# EasyEDA Pro project ModulePlayAndCharge.epro

# Schematic PlayAndCharge_REV1

## Sheets
1 Power: Board Name: PlayAndCharge_REV1_1; Create Date: 2025-07-18; Page Name: Power; Project Name: PlayAndChargeModule; Schematic Name: PlayAndCharge_REV1_1; Update Date: 2025-07-18; Company: ESP32SimWheel; Drawn: Afpineda; Page Size: A4; Version: V1.0
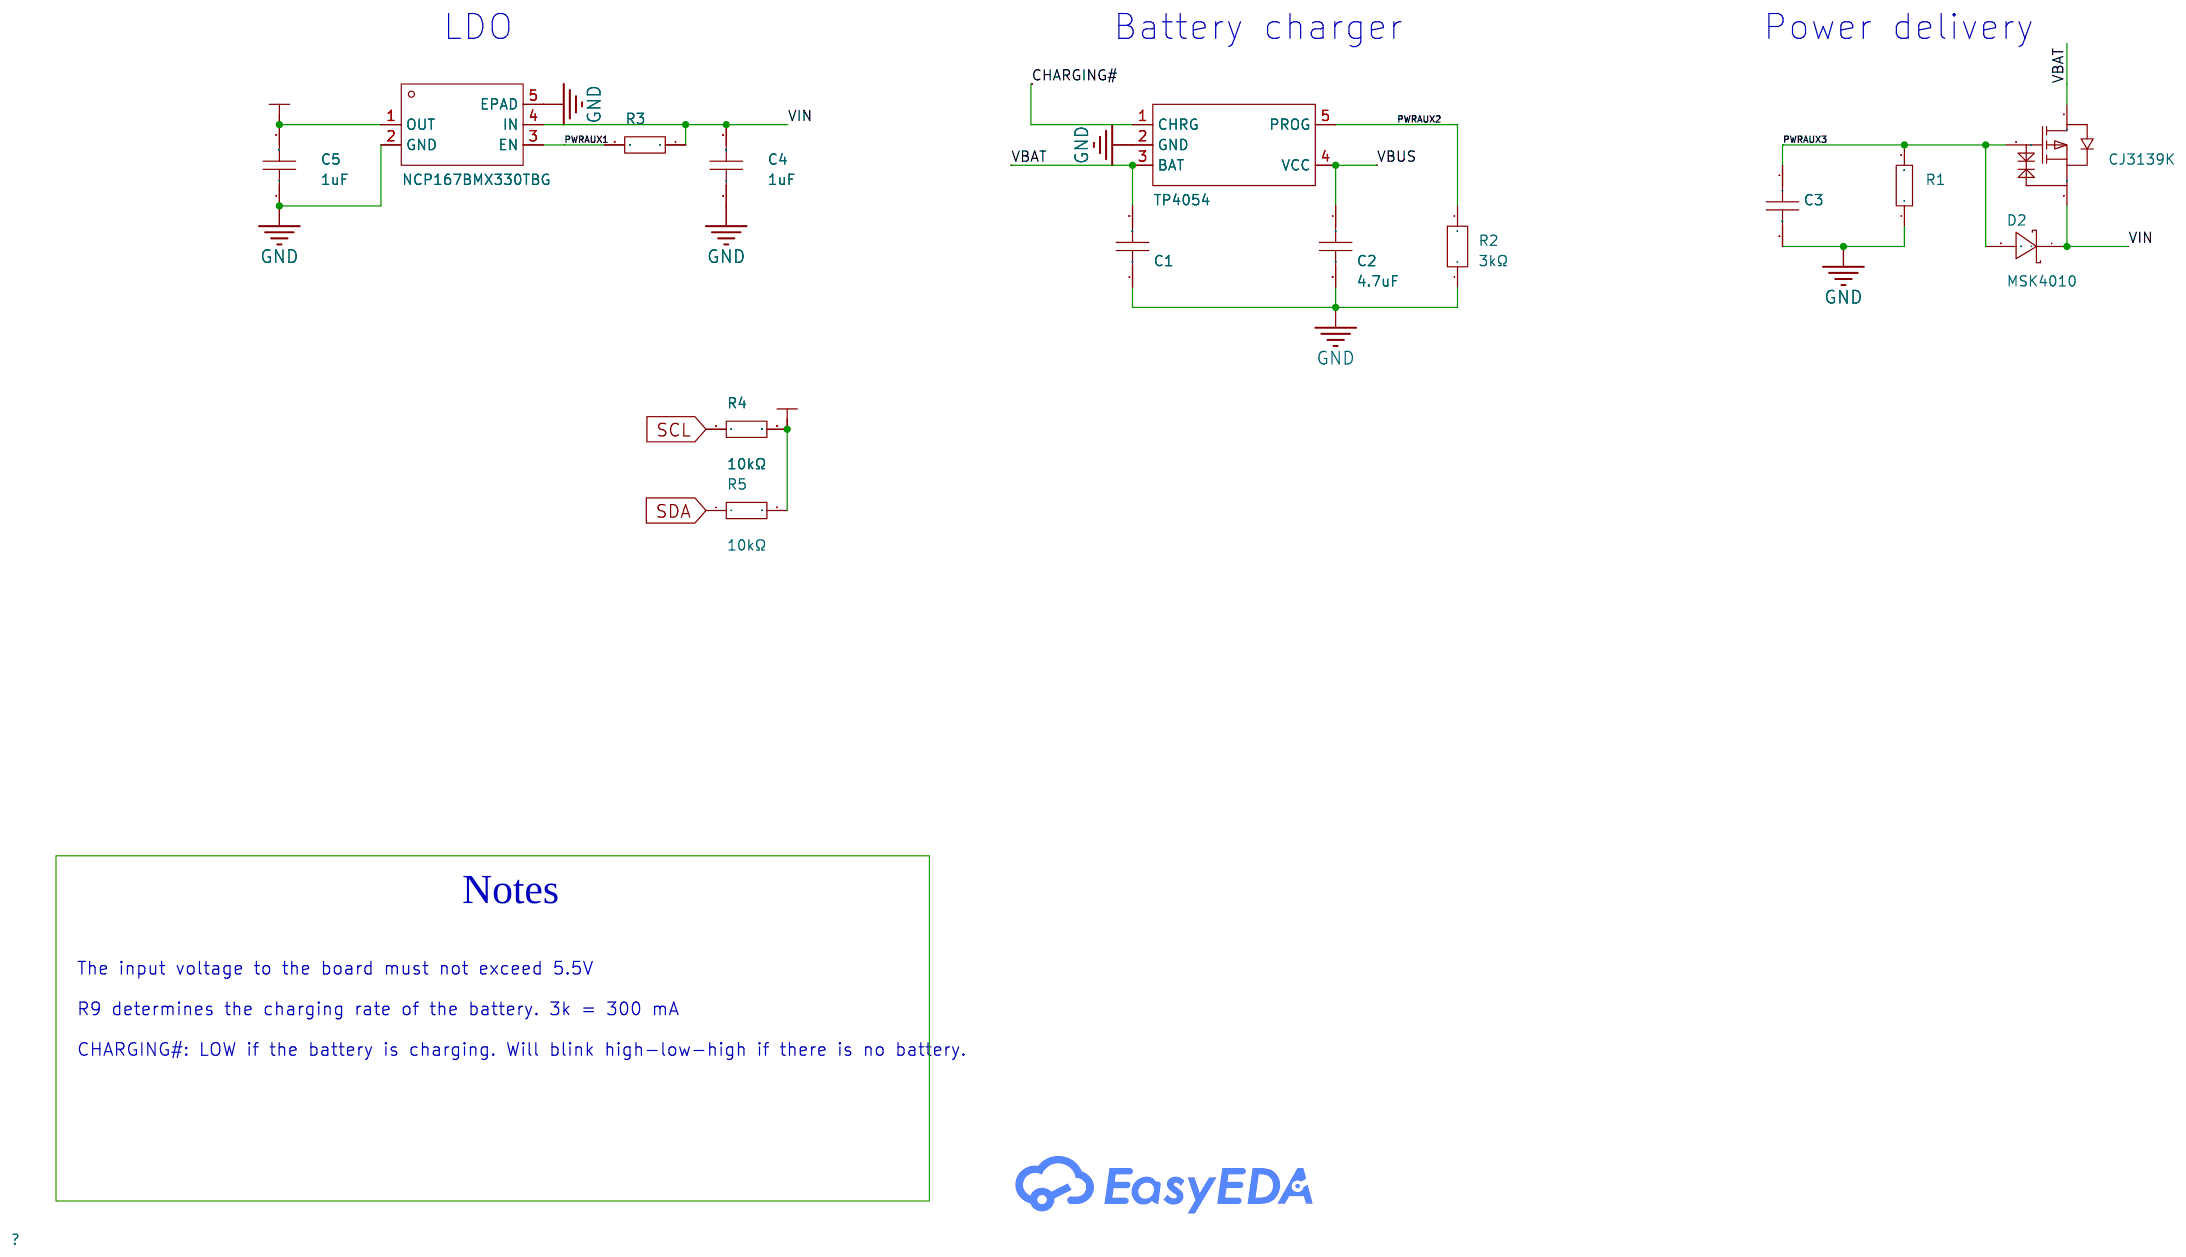
[diagram p0: Power]
2 GPIOExpanders: Board Name: PlayAndCharge_REV1; Page Name: GPIOExpanders; Schematic Name: PlayAndCharge_REV1
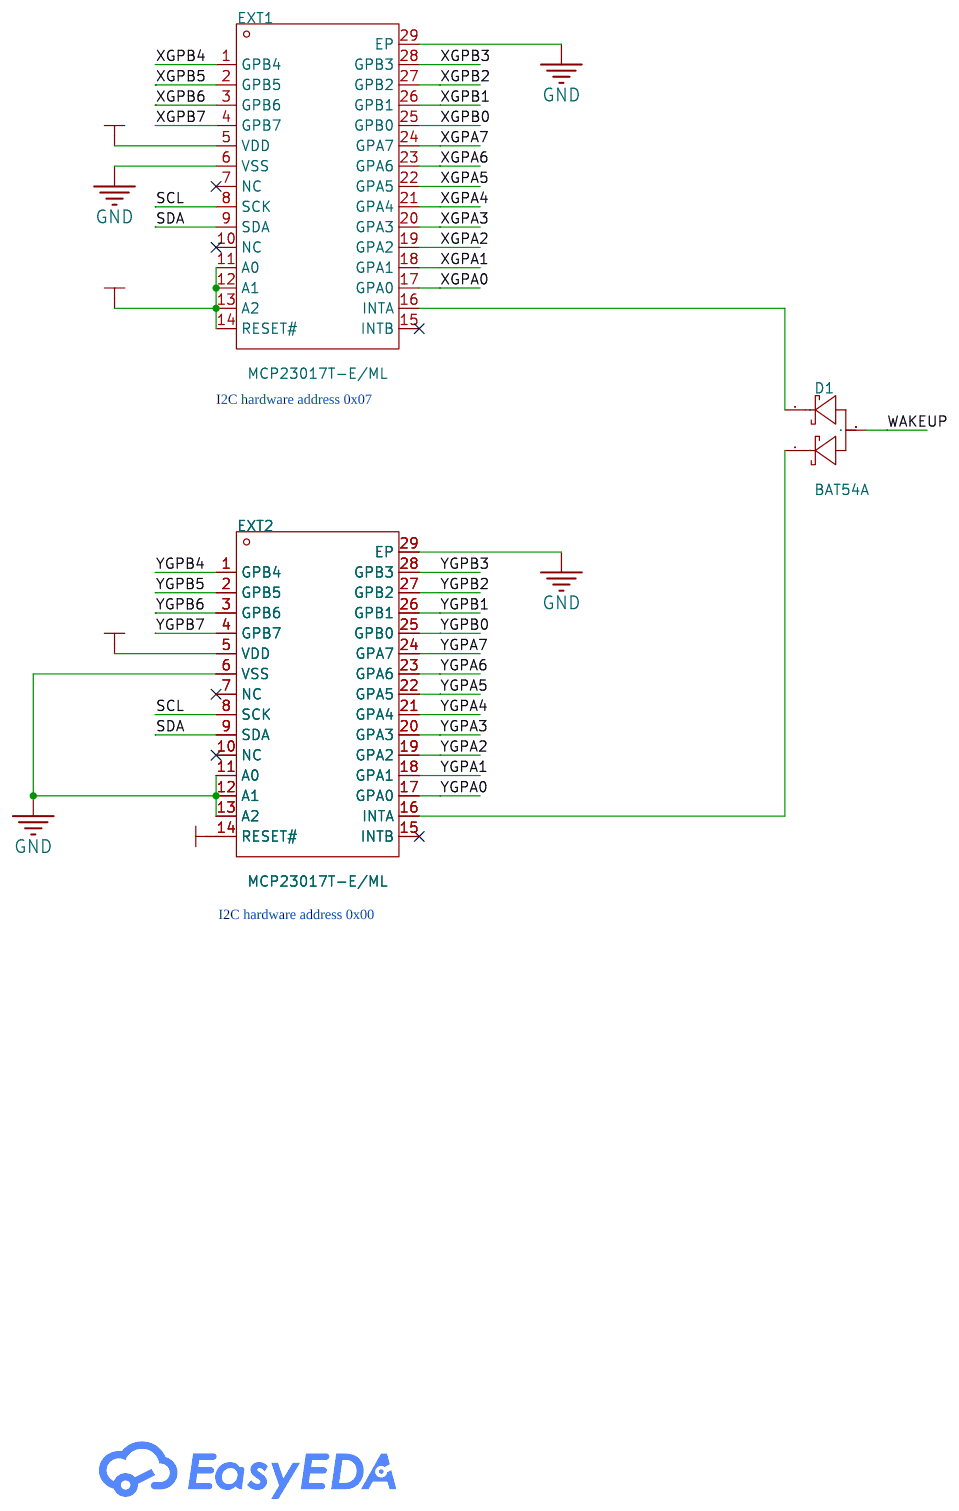
[diagram p1: GPIOExpanders]
3 Connectors: Board Name: PlayAndCharge_REV1; Page Name: Connectors; Schematic Name: PlayAndCharge_REV1; Company: EasyEDA.com
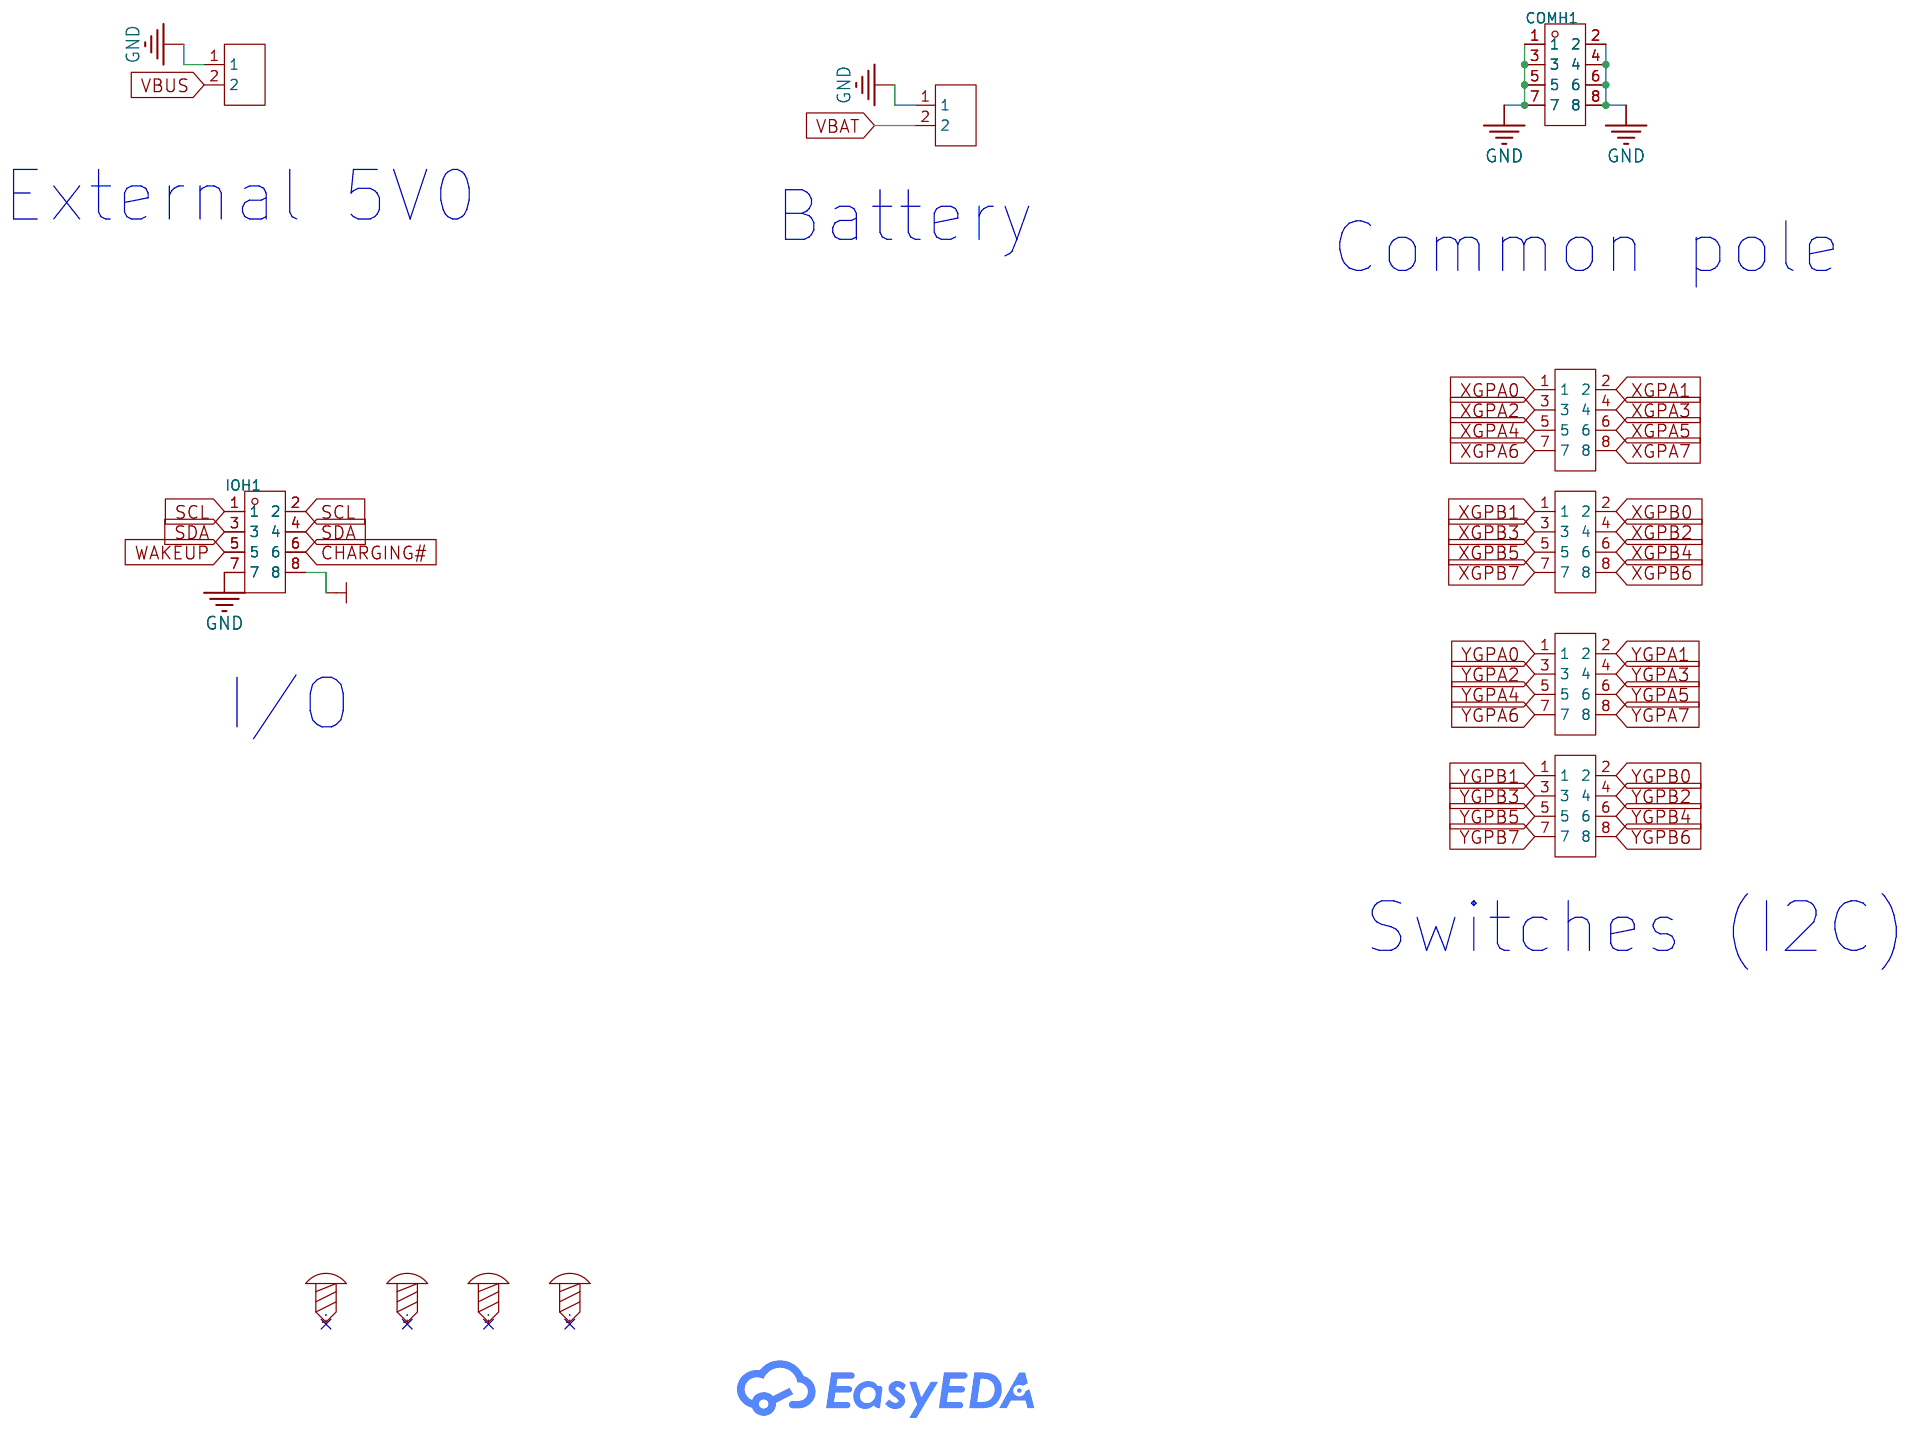
[diagram p2: Connectors]
4 FuelGauge: Board Name: SimWheelKit_batt_holder; Create Date: 2025-07-16; Page Name: FuelGauge; Project Name: SimWheelKit_ESP32_S3Mini_Batt; Schematic Name: Main_1; Update Date: 2025-07-16; Company: EasyEDA.com
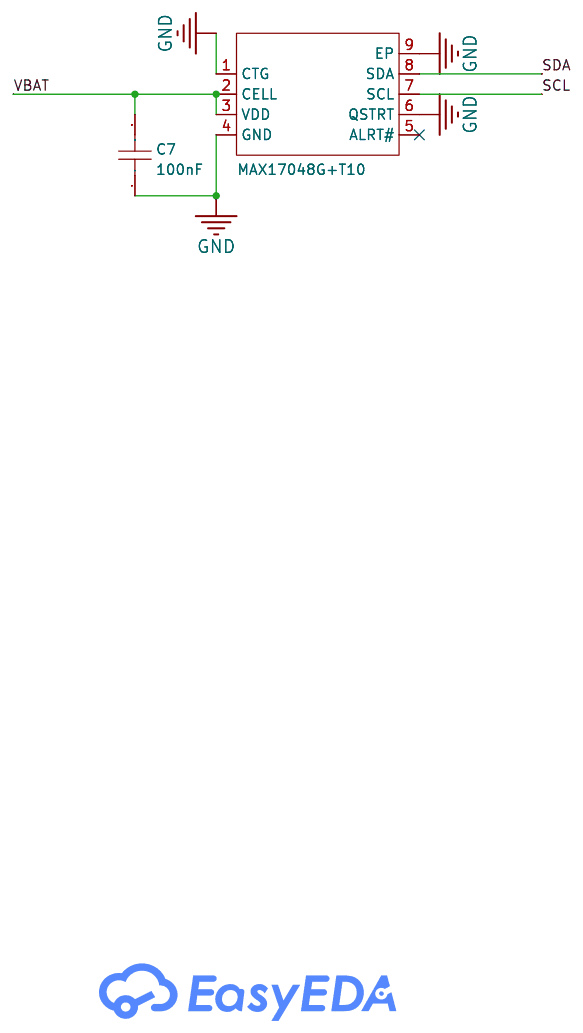
[diagram p3: FuelGauge]

## Parts
sheet Connectors
BATTH1  PZ254R-11-02P  [HDR-TH_2P-P2.54-H-M-W10.4]  (no BOM)
COMH1  PZ254R-12-8P  [HDR-TH_8P-P2.54-H-M-R2-C4-S2.54]
IOH1  PZ254R-12-8P  [HDR-TH_8P-P2.54-H-M-R2-C4-S2.54]
PWRH1  PZ254R-11-02P  [HDR-TH_2P-P2.54-H-M-W10.4]  (no BOM)
SCREW1  -  [Screw-Hole-M2]
SCREW2  -  [Screw-Hole-M2]
SCREW3  -  [Screw-Hole-M2]
SCREW4  -  [Screw-Hole-M2]
XH1  PZ254R-12-8P  [HDR-TH_8P-P2.54-H-M-R2-C4-S2.54]
XH2  PZ254R-12-8P  [HDR-TH_8P-P2.54-H-M-R2-C4-S2.54]
YH1  PZ254R-12-8P  [HDR-TH_8P-P2.54-H-M-R2-C4-S2.54]
YH2  PZ254R-12-8P  [HDR-TH_8P-P2.54-H-M-R2-C4-S2.54]
sheet FuelGauge
C7  100nF  [C0603]
U4  MAX17048G+T10  [TDFN-8_L2.0-W2.0-P0.50-BL-EP1.2]
sheet GPIOExpanders
D1  BAT54A  [SOT-23-3_L2.9-W1.3-P1.90-LS2.4-BR]
EXT1  MCP23017T-E/ML  [QFN-28_L6.0-W6.0-P0.65-BL-EP3.7]
EXT2  MCP23017T-E/ML  [QFN-28_L6.0-W6.0-P0.65-BL-EP3.7]
sheet Power
C1  10uF  [C0603]
C2  4.7uF  [C0402]
C3  10uF  [C0603]
C4  1uF  [C0603]
C5  1uF  [C0603]
D2  MSK4010  [SOD-523_L1.2-W0.8-LS1.6-RD]
Q1  CJ3139K  [SOT-723_L1.2-W0.8-P0.40-LS1.2-BR]
R1  100kΩ  [R0402]
R2  3kΩ  [R0402]
R3  100kΩ  [R0402]
R4  10kΩ  [R0402]
R5  10kΩ  [R0402]
U2  TP4054  [SOT-23-5_L2.9-W1.6-P0.95-LS2.8-BR]
U3  NCP167BMX330TBG  [XDFN-4_L1.0-W1.0-P0.65-BL-EP]

## Library data of the parts
BATTH1 PWRH1 = PZ254R-11-02P: Pin Structure:1x2P Pitch:2.54mm Row Spacing:- Circluar Pins/Square Pins:Policy Mounting Type:Right-Angle Number of Rows:Single Row Number of Pins:2P Current Rating:- Voltage Rating (Max):- Length of Mating Pin:6mm Insulation Height:2.5mm Contact Material:; LCSC Part Name: 1x2P 间距:2.54mm 方针 弯插; Supplier Part: C492410; Manufacturer: XFCN(兴飞); Supplier Footprint: 弯插,P=2.54mm; JLCPCB Part Class: Extended Part; Datasheet: https://atta.szlcsc.com/upload/public/pdf/source/20200309/C492410_AD20A982E51A4870F6FD4D2413672598.pdf; Supplier: LCSC; Pin Structure: 1x2P; Pitch: 2.54mm; Circluar Pins/Square Pins: Policy; Mounting Type: Right-Angle; Number of Rows: Single Row; Number of Pins: 2P; Length of Mating Pin: 6mm; Insulation Height: 2.5mm; Contact Material: Brass; Operating Temperature: -40℃~+105℃; Color: Black; Check: false
COMH1 IOH1 XH1 XH2 YH1 YH2 = PZ254R-12-8P: Pin Structure:2x4P Pitch:2.54mm Row Spacing:2.54mm Circluar Pins/Square Pins:Policy Mounting Type:Right-Angle Number of Rows:Double Row Number of Pins:8P Current Rating:- Voltage Rating (Max):- Length of Mating Pin:6mm Insulation Height:2.5mm Contact Mate; LCSC Part Name: 2x4P 间距:2.54mm 方针 弯插; Supplier Part: C492432; Manufacturer: XFCN(兴飞); Supplier Footprint: 弯插,P=2.54mm; JLCPCB Part Class: Extended Part; Datasheet: https://atta.szlcsc.com/upload/public/pdf/source/20200309/C492432_F55471C7391A7FE3415CB31C718B6320.pdf; Supplier: LCSC; Pin Structure: 2x4P; Pitch: 2.54mm; Row Spacing: 2.54mm; Circluar Pins/Square Pins: Policy; Mounting Type: Right-Angle; Number of Rows: Double Row; Number of Pins: 8P; Length of Mating Pin: 6mm; Insulation Height: 2.5mm; Contact Material: Brass; Operating Temperature: -40℃~+105℃; Color: Black
SCREW1-SCREW4 = Screw-Hole-M2: Supplier Footprint: 插件
C7 = CC0603KRX7R9BB104: Capacitance:100nF Tolerance:±10% Tolerance:±10% Voltage Rating:50V Temperature Coefficient:X7R; LCSC Part Name: 100nF ±10% 50V; Supplier Part: C14663; Manufacturer: YAGEO(国巨); Supplier Footprint: 0603; JLCPCB Part Class: Basic Part; Datasheet: https://atta.szlcsc.com/upload/public/pdf/source/20180910/C282072_33301C7F631E79921B82A8DAC6BCC5B3.pdf; Supplier: LCSC; Tolerance: ±10%; Voltage Rating: 50V; Temperature Coefficient: X7R
U4 = MAX17048G+T10: The Chip Type:Battery monitoring chip Voltage - Supply:2.5V~4.5V Voltage - Supply:2.5V~4.5V Type of Battery:Lithium-ion/Polymer Number of Cells:1 Number of Cells:1 Operating Temperature:-40℃~+85℃ Operating Temperature:-40℃~+85℃; LCSC Part Name: 单节/双节电池电量计使用ModelGauge技术; Supplier Part: C2682616; Manufacturer: ADI(亚德诺)/MAXIM(美信); Supplier Footprint: DFN-8-EP(2x2); JLCPCB Part Class: Extended Part; Datasheet: https://atta.szlcsc.com/upload/public/pdf/source/20210106/C2682616_818568B5D3BA4B627110FCAA33E0BFB1.pdf; Supplier: LCSC; The Chip Type: Battery monitoring chip; Voltage - Supply: 2.5V~4.5V; Type of Battery: Lithium-ion/Polymer; Number of Cells: 1; Operating Temperature: -40℃~+85℃
D1 = BAT54A_C727124: Diode Configuration:1 pair common anode Forward Voltage (Vf@If):1V@100mA Reverse Voltage (Vr):30V Rectified Current:200mA Reverse Leakage Current (Ir):2uA@25V; LCSC Part Name: 电压:30V 电流:200mA; Supplier Part: C727124; Manufacturer: TWGMC(台湾迪嘉); Supplier Footprint: SOT-23; JLCPCB Part Class: Extended Part; Datasheet: https://atta.szlcsc.com/upload/public/pdf/source/20200827/C727124_5D482B6B1AEFE8F49931502BEAC75010.pdf; Supplier: LCSC; Diode Configuration: 1 pair common anode; Forward Voltage (Vf@If): 1V@100mA; Reverse Voltage (Vr): 30V; Rectified Current: 200mA; Reverse Leakage Current (Ir): 2uA@25V
EXT1 EXT2 = MCP23017T-E/ML: Interface:- Number of I/O:16 Interrupt Output:With Interrupt Output Output Type:- Voltage - Supply:1.8V~5.5V Voltage - Supply:1.8V~5.5V Current - Output Low(IOL):- Current - Output High(IOH):- Clock Frequency:- Operating Temperature:-40℃~+125℃ Operating T; LCSC Part Name: 16位带串行接口的I/O扩展器; Supplier Part: C629439; Manufacturer: MICROCHIP(美国微芯); Supplier Footprint: QFN-28-EP(6x6); JLCPCB Part Class: Extended Part; Datasheet: https://atta.szlcsc.com/upload/public/pdf/source/20221209/1BF939F88C2D907BC056D7BF485E3103.pdf; Supplier: LCSC; Number of I/O: 16; Interrupt Output: With Interrupt Output; Voltage - Supply: 1.8V~5.5V; Operating Temperature: -40℃~+125℃
C1 C3 = CL10A106MQ8NNNC: Capacitance: Tolerance:±20% Tolerance:±20% Voltage Rated: Temperature Coefficient:; LCSC Part Name: 10uF ±20% 6.3V; Supplier Part: C1691; Manufacturer: SAMSUNG(三星); Supplier Footprint: 0603; JLCPCB Part Class: Extended Part; Datasheet: https://atta.szlcsc.com/upload/public/pdf/source/20160218/1457707763339.pdf; Supplier: LCSC; Tolerance: ±20%
C2 = CL05A475MP5NRNC: Capacitance: Tolerance:±20% Tolerance:±20% Voltage Rated: Temperature Coefficient:; LCSC Part Name: 4.7uF ±20% 10V; Supplier Part: C23733; Manufacturer: SAMSUNG(三星); Supplier Footprint: 0402; JLCPCB Part Class: Basic Part; Datasheet: https://atta.szlcsc.com/upload/public/pdf/source/20160218/1457707763339.pdf; Supplier: LCSC; Tolerance: ±20%
C4 C5 = CL10A105KB8NNNC: Capacitance: Tolerance:±10% Tolerance:±10% Voltage Rated: Temperature Coefficient:; LCSC Part Name: 1uF ±10% 50V; Supplier Part: C15849; Manufacturer: SAMSUNG(三星); Supplier Footprint: 0603; JLCPCB Part Class: Basic Part; Datasheet: https://atta.szlcsc.com/upload/public/pdf/source/20160218/1457707763339.pdf; Supplier: LCSC; Tolerance: ±10%
D2 = MSK4010_C345958: Diode Configuration:Single Forward Voltage (Vf@If):680mV@1A Reverse Voltage (Vr):50V Average Rectified Current (Io):1A Reverse Leakage Current (Ir):100uA@40V; LCSC Part Name: 电压:50V 电流:1A; Supplier Part: C345958; Manufacturer: SHIKUES(时科); Supplier Footprint: SOD-523; JLCPCB Part Class: Extended Part; Datasheet: https://atta.szlcsc.com/upload/public/pdf/source/20181210/C345958_12003F2D02FC173F30361002DF009B01.pdf; Supplier: LCSC; Diode Configuration: Single; Forward Voltage (Vf@If): 680mV@1A; Reverse Voltage (Vr): 50V; Average Rectified Current (Io): 1A; Reverse Leakage Current (Ir): 100uA@40V
Q1 = CJ3139K_C70022: Type:1 piece P-channel Drain to Source Voltage:20V Current - Continuous Drain(Id):660mA RDS(on):520mΩ@4.5V,0.66A Pd - Power Dissipation:150mW Gate Threshold Voltage (Vgs(th)@Id):350mV Input Capacitance(Ciss@Vds):170pF@16V Reverse Transfer Capacitance (Crs; LCSC Part Name: 1个P沟道 耐压:20V 电流:660mA; Supplier Part: C70022; Manufacturer: CJ(江苏长电/长晶); Supplier Footprint: SOT-723; JLCPCB Part Class: Extended Part; Datasheet: https://atta.szlcsc.com/upload/public/pdf/source/20160416/1460799391985.pdf; Supplier: LCSC; Type: 1 piece P-channel; Drain to Source Voltage: 20V; Current - Continuous Drain(Id): 660mA; RDS(on): 520mΩ@4.5V,0.66A; Pd - Power Dissipation: 150mW; Gate Threshold Voltage (Vgs(th)@Id): 350mV; Input Capacitance(Ciss@Vds): 170pF@16V; Reverse Transfer Capacitance (Crss@Vds): 15pF@16V; Operating Temperature: -55℃~+150℃
R1 R3 = 0402WGF1003TCE: Type:Thick Film Resistors Resistance:100kΩ Tolerance:±1% Tolerance:±1% Power(Watts): Overload Voltage (Max): Temperature Coefficient:±100ppm/℃ Temperature Coefficient:±100ppm/℃ Operating Temperature Range:-55℃~+155℃ Operating Temperature Range:-55℃~+155℃; LCSC Part Name: 100kΩ ±1% 62.5mW 厚膜电阻; Supplier Part: C25741; Manufacturer: UNI-ROYAL(厚声); Supplier Footprint: 0402; JLCPCB Part Class: Basic Part; Datasheet: https://atta.szlcsc.com/upload/public/pdf/source/20200306/C422600_1E6D84923E4A46A82E41ADD87F860B5C.pdf; Supplier: LCSC; Type: Thick Film Resistors; Tolerance: ±1%; Temperature Coefficient: ±100ppm/℃; Operating Temperature Range: -55℃~+155℃
R2 = FRC0402F3001TS: Type:Thick Film Resistors Resistance:3kΩ Tolerance:±1% Tolerance:±1% Power(Watts): Overload Voltage (Max): Temperature Coefficient:±100ppm/℃ Temperature Coefficient:±100ppm/℃ Operating Temperature Range:-55℃~+155℃ Operating Temperature Range:-55℃~+155℃; LCSC Part Name: 3kΩ ±1% 62.5mW 厚膜电阻; Supplier Part: C2909355; Manufacturer: FOJAN(富捷); Supplier Footprint: 0402; JLCPCB Part Class: Extended Part; Datasheet: https://atta.szlcsc.com/upload/public/pdf/source/20211221/925EC7D7225764EE0046F22065062C87.pdf; Supplier: LCSC; Type: Thick Film Resistors; Tolerance: ±1%; Temperature Coefficient: ±100ppm/℃; Operating Temperature Range: -55℃~+155℃
R4 R5 = 0402WGF1002TCE: Type:Thick Film Resistors Resistance:10kΩ Tolerance:±1% Tolerance:±1% Power(Watts): Overload Voltage (Max): Temperature Coefficient:±100ppm/℃ Temperature Coefficient:±100ppm/℃ Operating Temperature Range:-55℃~+155℃ Operating Temperature Range:-55℃~+155℃; LCSC Part Name: 10kΩ ±1% 62.5mW 厚膜电阻; Supplier Part: C25744; Manufacturer: UNI-ROYAL(厚声); Supplier Footprint: 0402; JLCPCB Part Class: Basic Part; Datasheet: https://atta.szlcsc.com/upload/public/pdf/source/20200306/C422600_1E6D84923E4A46A82E41ADD87F860B5C.pdf; Supplier: LCSC; Type: Thick Film Resistors; Tolerance: ±1%; Temperature Coefficient: ±100ppm/℃; Operating Temperature Range: -55℃~+155℃
U2 = TP4054_C5381776: The Chip Type:Battery management Voltage - Supply:- Voltage - Supply:- Charge Current - Max:500mA Charging Saturation Voltage:- End-Off Voltage:- Type of Battery:Lithium-ion/Polymer Number of Cells:1 Number of Cells:1 Operating Temperature:-40℃~+85℃ Opera; Supplier Part: C5381776; Manufacturer: JSMSEMI(杰盛微); Supplier Footprint: SOT-23-5; JLCPCB Part Class: Extended Part; Datasheet: https://atta.szlcsc.com/upload/public/pdf/source/20240105/B23E77B3239CBD8CB006536E3C384378.pdf; Supplier: LCSC; The Chip Type: Battery management; Charge Current - Max: 500mA; Type of Battery: Lithium-ion/Polymer; Number of Cells: 1; Operating Temperature: -40℃~+85℃
U3 = NCP167BMX330TBG: Output Type:Fixed Voltage - Supply:5.5V Output Voltage:3.3V Output Voltage:3.3V Output Current:700mA Power Supply Rejection Ratio (PSRR):85dB@(1kHz) standby current:- Features:Short Circuit Protection；Over Current Protection；Enable；Over Temperature Protec; Supplier Part: C892227; Manufacturer: onsemi(安森美); Supplier Footprint: XDFN-4-EP(1x1); JLCPCB Part Class: Extended Part; Datasheet: https://atta.szlcsc.com/upload/public/pdf/source/20210624/C892227_4E8EE9E6AF4A17859F0DD9B28B6DAE65.pdf; Supplier: LCSC; Output Type: Fixed; Voltage - Supply: 5.5V; Output Voltage: 3.3V; Output Current: 700mA; Power Supply Rejection Ratio (PSRR): 85dB@(1kHz); Features: Short Circuit Protection；Over Current Protection；Enable；Over Temperature Protection; Operating Temperature: -40℃~+125℃@(Tj); Output Configuration: Positive; Number of Outputs: 1

## Nets
3V3: C5.2 EXT1.5(VDD) EXT1.11(A0) EXT1.12(A1) EXT1.13(A2) EXT1.14(RESET#) EXT2.5(VDD) EXT2.14(RESET#) IOH1.8 R4.2 R5.2 U3.1(OUT)
GND: BATTH1.1 C1.1 C2.2 C3.2 C4.1 C5.1 C7.1 COMH1.1 COMH1.2 COMH1.3 COMH1.4 COMH1.5 COMH1.6 COMH1.7 COMH1.8 EXT1.6(VSS) EXT1.29(EP) EXT2.6(VSS) EXT2.11(A0) EXT2.12(A1) EXT2.13(A2) EXT2.29(EP) IOH1.7 PWRH1.1 R1.1 R2.1 U2.2(GND) U3.2(GND) U3.5(EPAD) U4.1(CTG) U4.4(GND) U4.6(QSTRT) U4.9(EP)
VBAT: BATTH1.2 C1.2 C7.2 Q1.3(D) U2.3(BAT) U4.2(CELL) U4.3(VDD)
VBUS: C2.1 PWRH1.2 U2.4(VCC)
VIN: C4.2 D2.1 Q1.2(S) R3.1 U3.4(IN)
CHARGING#: IOH1.6 U2.1(CHRG)
PWRAUX1: R3.2 U3.3(EN)
PWRAUX2: R2.2 U2.5(PROG)
PWRAUX3: C3.1 D2.2 Q1.1(G) R1.2
SCL: EXT1.8(SCK) EXT2.8(SCK) IOH1.1 IOH1.2 R4.1 U4.7(SCL)
SDA: EXT1.9(SDA) EXT2.9(SDA) IOH1.3 IOH1.4 R5.1 U4.8(SDA)
WAKEUP: D1.3(K) IOH1.5
XGPA0: EXT1.17(GPA0) XH1.1
XGPA1: EXT1.18(GPA1) XH1.2
XGPA2: EXT1.19(GPA2) XH1.3
XGPA3: EXT1.20(GPA3) XH1.4
XGPA4: EXT1.21(GPA4) XH1.5
XGPA5: EXT1.22(GPA5) XH1.6
XGPA6: EXT1.23(GPA6) XH1.7
XGPA7: EXT1.24(GPA7) XH1.8
XGPB0: EXT1.25(GPB0) XH2.2
XGPB1: EXT1.26(GPB1) XH2.1
XGPB2: EXT1.27(GPB2) XH2.4
XGPB3: EXT1.28(GPB3) XH2.3
XGPB4: EXT1.1(GPB4) XH2.6
XGPB5: EXT1.2(GPB5) XH2.5
XGPB6: EXT1.3(GPB6) XH2.8
XGPB7: EXT1.4(GPB7) XH2.7
YGPA0: EXT2.17(GPA0) YH1.1
YGPA1: EXT2.18(GPA1) YH1.2
YGPA2: EXT2.19(GPA2) YH1.3
YGPA3: EXT2.20(GPA3) YH1.4
YGPA4: EXT2.21(GPA4) YH1.5
YGPA5: EXT2.22(GPA5) YH1.6
YGPA6: EXT2.23(GPA6) YH1.7
YGPA7: EXT2.24(GPA7) YH1.8
YGPB0: EXT2.25(GPB0) YH2.2
YGPB1: EXT2.26(GPB1) YH2.1
YGPB2: EXT2.27(GPB2) YH2.4
YGPB3: EXT2.28(GPB3) YH2.3
YGPB4: EXT2.1(GPB4) YH2.6
YGPB5: EXT2.2(GPB5) YH2.5
YGPB6: EXT2.3(GPB6) YH2.8
YGPB7: EXT2.4(GPB7) YH2.7
$3N12421: D1.2(A) EXT2.16(INTA)
$3N12427: D1.1(A) EXT1.16(INTA)

Not connected (* = marked no-connect by the designer): EXT1 7(NC)* 10(NC)* 15(INTB)*; EXT2 7(NC)* 10(NC)* 15(INTB)*; SCREW1 1*; SCREW2 1*; SCREW3 1*; SCREW4 1*; U4 5(ALRT#)*

## Notes on the sheets
sheet 1
- LDO
- Battery charger
- Power delivery
- Notes
- The input voltage to the board must not exceed 5.5V
- R9 determines the charging rate of the battery. 3k = 300 mA
- CHARGING#: LOW if the battery is charging. Will blink high-low-high if there is no battery.
sheet 2
- I2C hardware address 0x07
- I2C hardware address 0x00
sheet 3
- External 5V0
- Battery
- Common pole
- I/O
- Switches (I2C)

# Board PCB_rev1
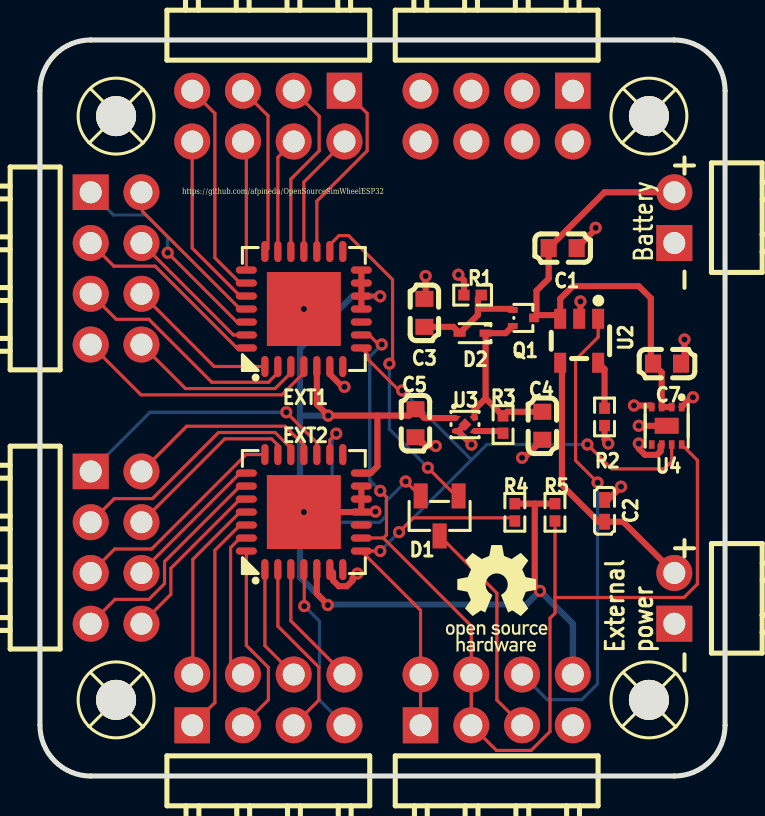
[diagram p4: board, top side]
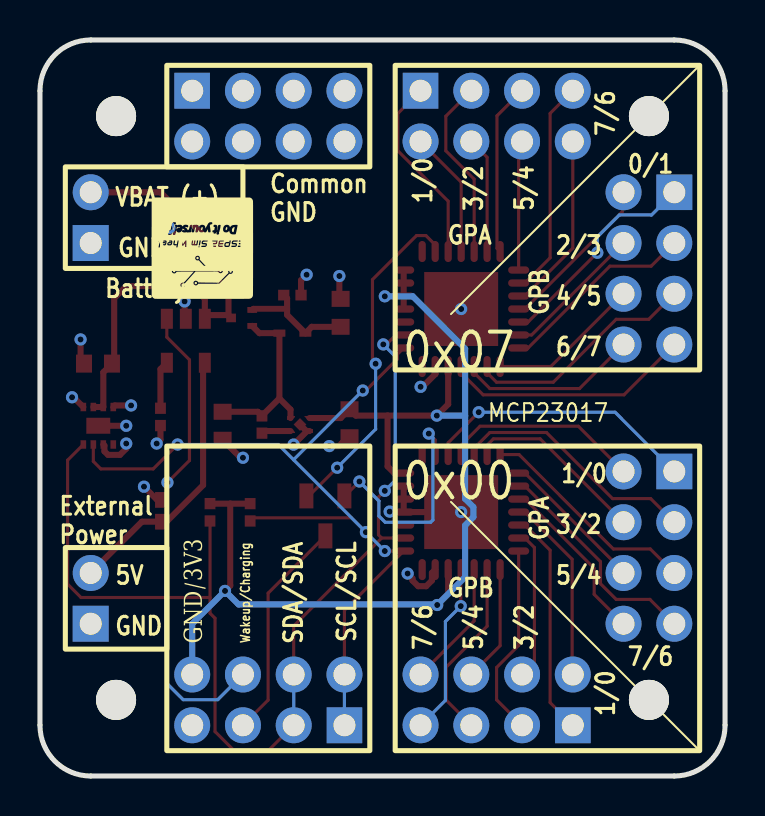
[diagram p5: board, bottom side, seen from below]

Outline 34.29 x 36.83 mm; copper layers: Top Layer, Inner1, Inner2, Bottom Layer. Coordinates in mm from the lower left corner of the outline.
Outline path: 0,34.29 0,2.54 arc(0.74,0.74) 2.54,0 31.75,0 arc(33.55,0.74) 34.29,2.54 34.29,34.29 arc(33.55,36.09) 31.75,36.83 2.54,36.83 arc(0.74,36.09) 0,34.29
Stack: Top Layer 0.035mm Outer layer thickness 1oz / Dielectric1 0.0994mm 3313 RC57% 4.2mil / Inner1 0.0152mm Inner layer thickness / Dielectric2 1.265mm 1.3mm H/HOZ Copper / Inner2 0.0152mm Inner layer thickness / Dielectric3 0.0994mm 3313 RC57% 4.2mil / Bottom Layer 0.035mm Outer layer thickness 1oz

## Design rules (mm)
net GND: PowerCls
net VBAT: PowerCls
net VIN: PowerCls
net VBUS: PowerCls
net PWRAUX3: PowerCls
net PWRAUX2: PowerCls
net PWRAUX1: PowerCls
template: Custom Config
spacing copperThickness1oz (default): track to track 0.102, other pairs 0.152 to 0.3
spacing copperThickness2oz: track to track 0.203, other pairs 0.152 to 0.3
track width copperThickness1oz (default): min 0.127, default 0.157, max 2.54
track width copperThickness2oz: min 0.203, default 0.254, max 2.54
track width Power1oz: min 0.254, default 0.305, max 2.54
differential pair differentialPair (default): width min 0.127, default 0.254, max 2.54; gap min 0.152, default 0.152
via viaSize (default): diameter min 0.5, default 0.61, max 10; hole min 0.3, default 0.305, max 6.299
net class PowerCls uses Power1oz
net GND uses Power1oz
net VBAT uses Power1oz
net VIN uses Power1oz
net VBUS uses Power1oz
net PWRAUX3 uses Power1oz
net PWRAUX2 uses Power1oz
net PWRAUX1 uses Power1oz

## Placement (name value [footprint] x y rotation side)
BATTH1  PZ254R-11-02P  [HDR-TH_2P-P2.54-H-M-W10.4]  31.75 27.94 90 top
C1  10uF  [C0603]  26.16 26.42 180 top
C2  4.7uF  [C0402]  28.26 13.27 90 top
C3  10uF  [C0603]  19.24 23.18 90 top
C4  1uF  [C0603]  25.15 17.53 90 top
C5  1uF  [C0603]  18.8 17.65 90 top
C7  100nF  [C0603]  31.39 20.64 180 top
COMH1  PZ254R-12-8P  [HDR-TH_8P-P2.54-H-M-R2-C4-S2.54]  22.86 33.02 180 top
D1  BAT54A  [SOT-23-3_L2.9-W1.3-P1.90-LS2.4-BR]  20 13.02 90 top
D2  MSK4010  [SOD-523_L1.2-W0.8-LS1.6-RD]  21.66 22.16 180 top
EXT1  MCP23017T-E/ML  [QFN-28_L6.0-W6.0-P0.65-BL-EP3.7]  13.21 23.37 0 top
EXT2  MCP23017T-E/ML  [QFN-28_L6.0-W6.0-P0.65-BL-EP3.7]  13.21 13.21 0 top
IOH1  PZ254R-12-8P  [HDR-TH_8P-P2.54-H-M-R2-C4-S2.54]  22.86 3.81 0 top
PWRH1  PZ254R-11-02P  [HDR-TH_2P-P2.54-H-M-W10.4]  31.75 8.89 90 top
Q1  CJ3139K  [SOT-723_L1.2-W0.8-P0.40-LS1.2-BR]  24.19 22.92 180 top
R1  100kΩ  [R0402]  21.66 24.06 0 top
R2  3kΩ  [R0402]  28.26 17.97 90 top
R3  100kΩ  [R0402]  23.18 17.59 270 top
R4  10kΩ  [R0402]  23.77 13.2 90 top
R5  10kΩ  [R0402]  25.78 13.2 90 top
SCREW1  -  [Screw-Hole-M2]  30.48 33.02 0 top
SCREW2  -  [Screw-Hole-M2]  30.48 3.81 0 top
SCREW3  -  [Screw-Hole-M2]  3.81 33.02 0 top
SCREW4  -  [Screw-Hole-M2]  3.81 3.81 0 top
U2  TP4054  [SOT-23-5_L2.9-W1.6-P0.95-LS2.8-BR]  26.99 21.78 90 top
U3  NCP167BMX330TBG  [XDFN-4_L1.0-W1.0-P0.65-BL-EP]  21.27 17.59 270 top
U4  MAX17048G+T10  [TDFN-8_L2.0-W2.0-P0.50-BL-EP1.2]  31.37 17.53 180 top
XH1  PZ254R-12-8P  [HDR-TH_8P-P2.54-H-M-R2-C4-S2.54]  11.43 33.02 180 top
XH2  PZ254R-12-8P  [HDR-TH_8P-P2.54-H-M-R2-C4-S2.54]  3.81 25.4 270 top
YH1  PZ254R-12-8P  [HDR-TH_8P-P2.54-H-M-R2-C4-S2.54]  3.81 11.43 270 top
YH2  PZ254R-12-8P  [HDR-TH_8P-P2.54-H-M-R2-C4-S2.54]  11.43 3.81 0 top

## Footprints (pads in the part's own frame, mm; a bottom-side part is the same pattern mirrored in y, then rotated)
C0402
  rect 0.79x0.54 smd: 1(-0.545,0) 2(0.545,0)
C0603
  rect 0.8x0.9 smd: 1(-0.7,0) 2(0.7,0)
HDR-TH_2P-P2.54-H-M-W10.4
  rect 1.8x1.8 hole 1.1: 1(-1.27,0)
  round 1.8 hole 1.1: 2(1.27,0)
HDR-TH_8P-P2.54-H-M-R2-C4-S2.54
  rect 1.778x1.8 hole 1.1: 1(-3.81,-1.27)
  round 1.8 hole 1.1: 2(-3.81,1.27) 3(-1.27,-1.27) 4(-1.27,1.27) 5(1.27,-1.27) 6(1.27,1.27) 7(3.81,-1.27) 8(3.81,1.27)
QFN-28_L6.0-W6.0-P0.65-BL-EP3.7
  oval 0.364x1.055 smd: 1(-1.95,-2.877) 2(-1.3,-2.877) 3(-0.65,-2.877) 4(0,-2.877) 5(0.65,-2.877) 6(1.3,-2.877) 7(1.95,-2.877) 15(1.95,2.877) 16(1.3,2.877) 17(0.65,2.877) 18(0,2.877) 19(-0.65,2.877) 20(-1.3,2.877) 21(-1.95,2.877)
  oval 1.055x0.364 smd: 8(2.877,-1.95) 9(2.877,-1.3) 10(2.877,-0.65) 11(2.877,0) 12(2.877,0.65) 13(2.877,1.3) 14(2.877,1.95) 22(-2.877,1.95) 23(-2.877,1.3) 24(-2.877,0.65) 25(-2.877,0) 26(-2.877,-0.65) 27(-2.877,-1.3) 28(-2.877,-1.95)
  rect 3.7x3.7 smd: 29(0,0)
R0402
  rect 0.566x0.54 smd: 1(-0.433,0) 2(0.433,0)
Screw-Hole-M2
  round 2 hole 2: 1(0,0)
SOD-523_L1.2-W0.8-LS1.6-RD
  rect 0.6x0.36 smd: 1(-0.65,0) 2(0.65,0)
SOT-23-3_L2.9-W1.3-P1.90-LS2.4-BR
  rect 1.25x0.7 smd: 1(1,-0.95) 2(1,0.95) 3(-1,0)
SOT-23-5_L2.9-W1.6-P0.95-LS2.8-BR
  rect 1x0.6 smd: 1(1.1,-0.95) 2(1.1,0) 3(1.1,0.95) 4(-1.1,0.95) 5(-1.1,-0.95)
SOT-723_L1.2-W0.8-P0.40-LS1.2-BR
  rect 0.489x0.294 smd: 1(0.529,-0.4) 2(0.529,0.4)
  rect 0.489x0.434 smd: 3(-0.529,0)
TDFN-8_L2.0-W2.0-P0.50-BL-EP1.2
  rect 0.28x0.425 smd: 1(-0.75,-0.938) 2(-0.25,-0.938) 3(0.25,-0.938) 4(0.75,-0.938) 5(0.75,0.938) 6(0.25,0.938) 7(-0.25,0.938) 8(-0.75,0.938)
  rect 1.2x0.8 smd: 9(0,0)
XDFN-4_L1.0-W1.0-P0.65-BL-EP
  custom 0.2x0.45 smd: 1(-0.325,-0.475)
  custom 0.2x0.4 smd: 2(0.325,-0.475) 3(0.325,0.475) 4(-0.325,0.475)
  rect 0.45x0.45 smd rot 45: 5(0,0)

## Nets
As in the schematic.

Pads without a net: EXT1 7 10 15; EXT2 7 10 15; SCREW1 1; SCREW2 1; SCREW3 1; SCREW4 1; U4 5

## Via types
v1: diameter 0.61, hole 0.305, Top Layer to Bottom Layer, 37 vias

## Routing (per net, layer and track width the routed paths; a pad name or vN(x,y) marks a point on that pad's centre or on a via; arc(x,y) is an arc through that point)
3V3: length 60.3
  Top Layer w0.158: v1(17.03,24) 17.01,24.02 EXT1.12
  Top Layer w0.305: v1(25.03,9.26) 24.77,9.53 24.77,13.63 ; 24.77,13.63 25.74,13.63 25.78,13.67 ; 24.77,13.63 R4.2 ; 16.89,18.03 18.48,18.03 C5.2 19.24,17.91 U3.1 ; 16.89,18.03 16.89,15.49 16.56,15.16 EXT2.14 ; 16.89,18.03 14.48,18.03 ; EXT1.14 EXT1.13 EXT1.12 EXT1.11 ; v1(14.43,18.03) 13.86,18.6 EXT1.5 ; EXT2.5 13.86,9.13 14.35,8.64 14.35,8.61 v1(14.41,8.56)
  Bottom Layer w0.305: 13.01,18.03 13.01,21.38 15.63,24 v1(17.03,24) ; 13.01,18.03 13.01,13.87 12.6,13.46 12.6,12.96 13.01,12.54 13.01,9.95 v1(14.41,8.56) 14.43,8.59 24.35,8.59 v1(25.03,9.26) 26.67,7.62 IOH1.8 ; 13.01,18.03 13.02,18.03 v1(14.43,18.03)
GND: length 25.7
  Top Layer w0.305: C5.1 19.08,16.67 19.16,16.67 19.32,16.51 v1(19.81,16.51) ; v1(19.3,25.02) 19.3,23.94 C3.2 ; C2.2 28.42,13.81 v1(29.08,14.48) ; C1.1 27.81,27.37 v1(27.81,27.43) ; EXT2.11 16.76,13.21 v1(16.79,13.23) ; EXT2.11 EXT2.12 EXT2.13 ; EXT2.11 v1(13.21,13.21) ; v1(24.13,15.93) 24.25,15.93 C4.1 ; C7.1 32.26,20.81 v1(32.26,21.84) ; U4.9 v1(29.97,17.53) ; EXT2.6 14.67,10.17 14.67,9.78 14.96,9.5 15.36,9.5 15.65,9.78 15.65,9.89 v1(15.89,10.13) ; R2.1 28.26,16.83 v1(28.45,16.64) ; 20.92,17.26 v1(21.6,16.58) ; 20.92,17.26 20.95,17.26 U3.5 ; 20.92,17.26 U3.2 ; EXT1.6 14.51,20.11 15.14,19.47 v1(15.24,19.47) ; U4.1 32.61,18.95 v1(32.68,18.95) ; v1(29.97,16.64) 29.97,16.38 30.28,16.07 30.88,16.07 31.06,16.25 31.06,16.53 U4.6 ; U4.4 30.54,18.54 v1(29.73,18.54) ; R1.1 21.22,24.8 v1(20.94,25.08) ; U2.2 27.05,22.94 v1(27.05,23.75)
  vias: v1(13.21,23.37)
VBAT: length 24.7
  Top Layer w0.305: 24.85,23.06 Q1.3 ; 24.85,23.06 24.85,24.28 25.46,24.89 C1.2 28.26,29.21 BATTH1.2 ; 24.85,23.06 25.85,23.06 U2.3 26.04,23.88 26.67,24.51 29.97,24.51 30.58,23.91 30.58,20.75 C7.2 31.12,20.2 U4.3 U4.2
VBUS: length 13.6
  Top Layer w0.305: U2.4 26.13,20.59 26.13,14.55 27.95,12.73 29.19,12.73 PWRH1.2
VIN: length 9.3
  Top Layer w0.305: 22.31,18.89 21.75,18.34 U3.4 ; 22.31,18.89 R3.1 23.38,18.23 C4.2 ; 22.31,18.89 D2.1 23.3,22.16 Q1.2
CHARGING#: length 23.8
  Top Layer w0.158: v1(27.91,14.69) 26.81,15.79 26.81,20.83 27.94,21.96 U2.1
  Bottom Layer w0.158: v1(27.91,14.69) 27.91,4.61 27.12,3.82 25.39,3.82 IOH1.6
PWRAUX1: length 1.5
  Top Layer w0.305: R3.2 23.07,17.26 U3.3
PWRAUX2: length 2.4
  Top Layer w0.305: U2.5 28.26,20.36 R2.2
PWRAUX3: length 6
  Top Layer w0.294: 21.92,23.38 23.61,23.38 Q1.1
  Top Layer w0.305: C3.1 20.69,22.48 D2.2 21.92,23.07 21.92,23.9 R1.2
SCL: length 45.9
  Top Layer w0.158: R4.1 23.61,12.92 18.69,12.92 v1(17.98,12.2) ; v1(18.13,19.29) 17.98,19.29 16.4,20.86 16.4,21.1 EXT1.8 ; v1(17.03,11.26) EXT2.8 19.05,8.29 IOH1.2 IOH1.1 ; v1(27.4,16.59) 28.62,15.37 31.24,15.37 31.62,15.74 U4.7
  Bottom Layer w0.158: v1(27.4,16.59) 22.36,16.59 21.6,15.83 ; 21.6,15.83 v1(17.98,12.2) v1(17.03,11.26) ; 21.6,15.83 v1(18.13,19.29) ; IOH1.1 IOH1.2
SDA: length 56.6
  Top Layer w0.158: 17.19,11.91 17.35,12.07 17.35,13.96 v1(17.03,14.27) ; 17.19,11.91 EXT2.9 ; 17.19,11.91 21.59,7.51 IOH1.4 IOH1.3 22.85,1.28 24.58,1.28 25.53,2.23 25.53,7.89 25.78,8.15 25.78,8.93 ; 25.78,8.93 32.24,8.93 32.91,9.6 32.91,15.8 U4.8 ; 25.78,8.93 25.78,12.8 ; v1(17.11,21.6) 16.95,21.6 16.48,22.07 EXT1.9
  Bottom Layer w0.158: v1(17.11,21.6) 16.51,21 16.51,14.79 v1(17.03,14.27) ; IOH1.3 IOH1.4
WAKEUP: length 11.2
  Top Layer w0.158: D1.3 22.87,9.15 22.87,3.8 IOH1.5
XGPA0: length 9.6
  Top Layer w0.158: EXT1.17 13.86,28.77 16.38,31.28 16.38,33.15 XH1.1
XGPA1: length 6.3
  Top Layer w0.158: EXT1.18 13.21,29.72 XH1.2
XGPA2: length 9.2
  Top Layer w0.158: EXT1.19 12.56,29.87 13.98,31.28 13.98,33.01 XH1.3
XGPA3: length 5.8
  Top Layer w0.158: EXT1.20 11.91,30.96 XH1.4
XGPA4: length 8.6
  Top Layer w0.158: EXT1.21 11.42,26.4 11.42,33.03 XH1.5
XGPA5: length 6.5
  Top Layer w0.158: XH1.6 10.33,31.58 EXT1.22
XGPA6: length 10.9
  Top Layer w0.158: EXT1.23 10.02,24.67 8.76,25.93 8.76,33.15 XH1.7
XGPA7: length 9
  Top Layer w0.158: XH1.8 7.62,26.41 10.02,24.02 EXT1.24
XGPB0: length 8.2
  Top Layer w0.158: EXT1.25 10.02,23.37 5.13,28.25 5.13,29.16 XH2.2
XGPB1: length 10.9
  Top Layer w0.158: v1(6.39,26.18) 9.86,22.72 EXT1.26
  Bottom Layer w0.158: v1(6.39,26.18) 6.39,26.97 5.29,28.07 3.68,28.07 XH2.1
XGPB2: length 7.2
  Top Layer w0.158: XH2.4 9.68,22.07 EXT1.27
XGPB3: length 10
  Top Layer w0.158: XH2.3 3.7,25.51 5.76,25.51 9.86,21.42 EXT1.28
XGPB4: length 7.7
  Top Layer w0.158: XH2.6 8.72,20.49 EXT1.1
XGPB5: length 11.7
  Top Layer w0.158: XH2.5 3.82,22.85 5.45,22.85 8.6,19.7 11.44,19.7 11.91,20.18 EXT1.2
XGPB6: length 9
  Top Layer w0.158: EXT1.3 12.56,20.18 11.77,19.39 7.28,19.39 XH2.8
XGPB7: length 12.5
  Top Layer w0.158: EXT1.4 13.21,20.18 12.11,19.07 5.06,19.07 XH2.7
YGPA0: length 13.8
  Top Layer w0.158: EXT2.17 13.86,16.67 v1(12.33,18.2)
  Bottom Layer w0.158: v1(12.33,18.2) 5.5,18.2 YH1.1
YGPA1: length 9.9
  Top Layer w0.158: EXT2.18 13.21,16.56 12.26,17.5 7.34,17.5 YH1.2
YGPA2: length 12.5
  Top Layer w0.158: EXT2.19 12.56,16.4 11.77,17.19 8.94,17.19 5.63,13.88 3.72,13.88 YH1.3
YGPA3: length 9.2
  Top Layer w0.158: YH1.4 9.25,16.87 11.59,16.87 11.91,16.56 EXT2.20
YGPA4: length 11.2
  Top Layer w0.158: EXT2.21 10.31,16.09 5.59,11.36 3.74,11.36 YH1.5
YGPA5: length 7.4
  Top Layer w0.158: EXT2.22 10.02,15.16 5.08,10.22 YH1.6
YGPA6: length 11.3
  Top Layer w0.158: YH1.7 3.76,8.84 5.45,8.84 6.24,9.63 6.24,10.73 10.02,14.51 EXT2.23
YGPA7: length 8.6
  Top Layer w0.158: EXT2.24 10.02,13.86 6.55,10.39 6.55,9.09 YH1.8
YGPB0: length 9.4
  Top Layer w0.158: YH2.2 7.65,5.11 7.65,10.85 10.02,13.21 EXT2.25
YGPB1: length 11.3
  Top Layer w0.158: EXT2.26 10.02,12.56 8.76,11.3 8.76,3.68 YH2.1
YGPB2: length 7.6
  Top Layer w0.158: YH2.4 9.54,5.7 9.54,11.44 10.02,11.91 EXT2.27
YGPB3: length 9.7
  Top Layer w0.158: EXT2.28 10.33,6.53 11.43,5.43 11.43,3.81 YH2.3
YGPB4: length 5.8
  Top Layer w0.158: YH2.6 11.26,6.52 EXT2.1
YGPB5: length 9.2
  Top Layer w0.158: EXT2.2 11.91,7.5 13.96,5.45 13.96,3.8 YH2.5
YGPB6: length 6.4
  Top Layer w0.158: EXT2.3 12.56,7.76 15.24,5.09
YGPB7: length 8.6
  Top Layer w0.158: EXT2.4 13.21,10.02 13.23,10 v1(13.23,8.5)
  Bottom Layer w0.158: YH2.7 14,3.78 14,7.73 v1(13.23,8.5)
$3N12421: length 11.7
  Top Layer w0.158: D1.2 19.02,14.02 v1(18.3,14.74) ; EXT2.16 14.51,16.81 v1(14.83,17.13)
  Bottom Layer w0.158: v1(18.3,14.74) 17.32,13.76 17.32,13.01 17.01,12.7 16.57,12.7 16.56,12.7 14.73,12.7 14.62,12.81 14.62,16.92 v1(14.83,17.13)
$3N12427: length 17
  Top Layer w0.158: EXT1.16 14.51,26.58 14.97,27.04 15.44,27.04 17.65,24.84 17.65,20.79 v1(17.49,20.63) ; D1.1 20.83,14.02 v1(19.41,15.43)
  Bottom Layer w0.158: v1(17.49,20.63) 17.49,17.35 v1(19.41,15.43)

## Copper pours and planes (outline as drawn; the poured copper is in the pictures)
GND on Inner1: 0.26,36.57 34.03,36.57 34.03,0.26 0.26,0.26
GND on Inner2: 0.26,36.57 34.03,36.57 34.03,0.26 0.26,0.26

Small or netless copper shapes (teardrops, artwork), in the pictures only: 44 on Inner1, 44 on Inner2

## Text on the board
Bottom Silkscreen Layer: Wakeup/Charging | MCP23017 | Common / GND | GND (-) | 5V | GND | VBAT (+) | Battery | External / Power | 7/6 | 1/0 | 5/4 | 3/2 | SCL/SCL | SDA/SDA | GPA | GPB | 0/1 | 2/3 | 4/5 | 6/7 | 0x07 | 0x00 | GND/3V3
Top Silkscreen Layer: Battery | External / power | + | - | https://github.com/afpineda/OpenSourceSimWheelESP32
